# EAGLE design Power Jack Adpater (EAGLE 7.7.0)
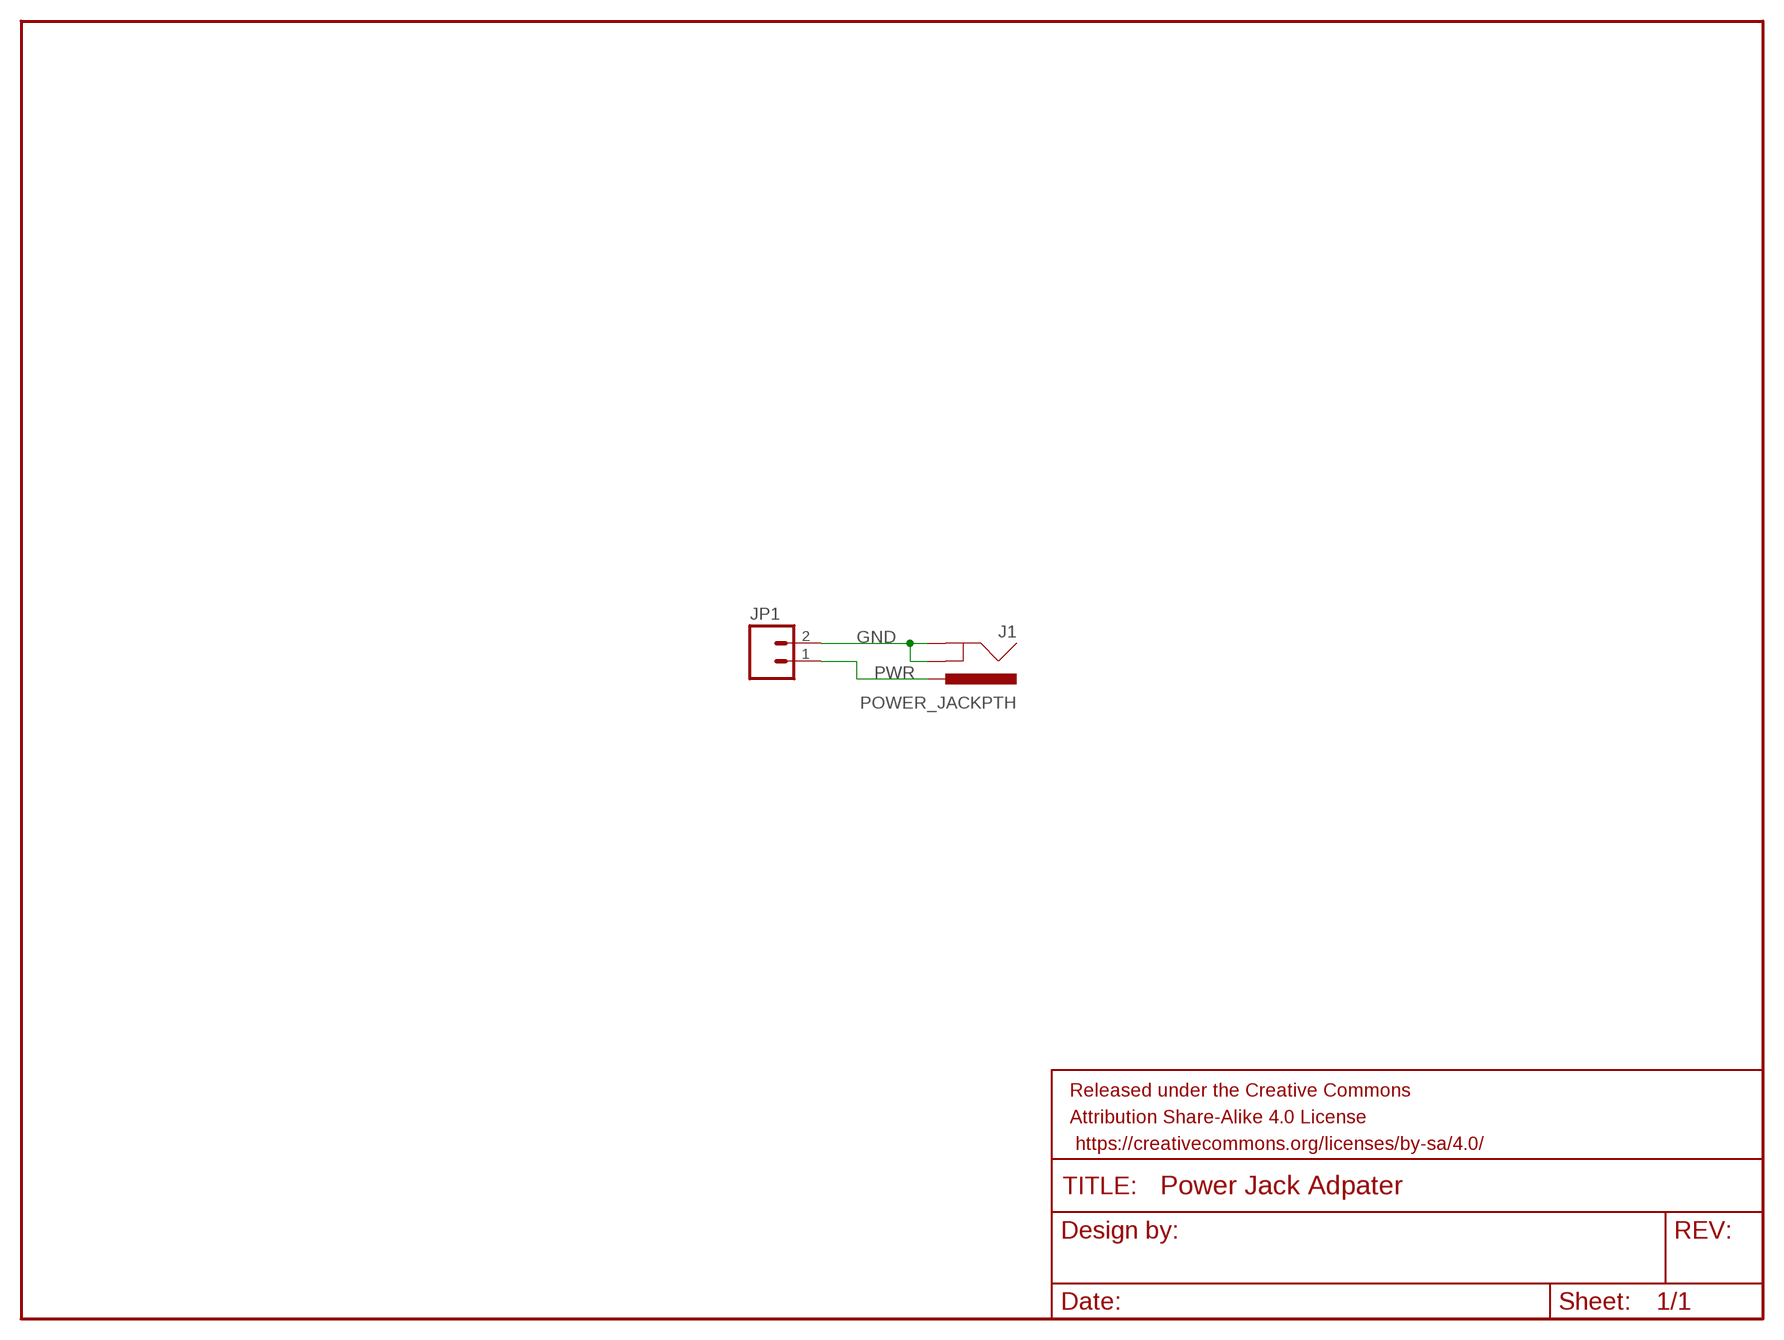
[diagram p0: schematic, sheet 1]

## Parts
FRAME1  FRAME-LETTER  [CREATIVE_COMMONS]
J1  POWER_JACKPTH  [POWER_JACK_PTH]
JP1  M02LOCK_LONGPADS  [1X02_LOCK_LONGPADS]

## Nets
GND: J1.GND J1.GNDBREAK JP1.2
PWR: J1.PWR JP1.1

## Library data of the parts
FRAME1 = 1-Generic:FRAME-LETTER: Schematic Frame Standard 8.5x11 US Letter frame
J1 = SparkFun:POWER_JACK: Power Jack This is the standard 5.5mm barrel jack for power. The PTH is the most common, proven, reliable, footprint. All others are experimental. The Slot footprint only works if the mill layer is transmitted to the PCB fab house so be warned. Spark Fun Electronics SKU : PRT-00119. Mating wall wart : TOL-00298 (and others)
JP1 = 1-Generic:M02: Header 2 Standard 2-pin 0.1" header. Use with straight break away headers (SKU : PRT-00116), right angle break away headers (PRT-00553), swiss pins (PRT-00743), machine pins (PRT-00117), and female headers (PRT-00115). Molex polarized connector foot print use with SKU : PRT-08233 with associated crimp pins and housings.

## Board
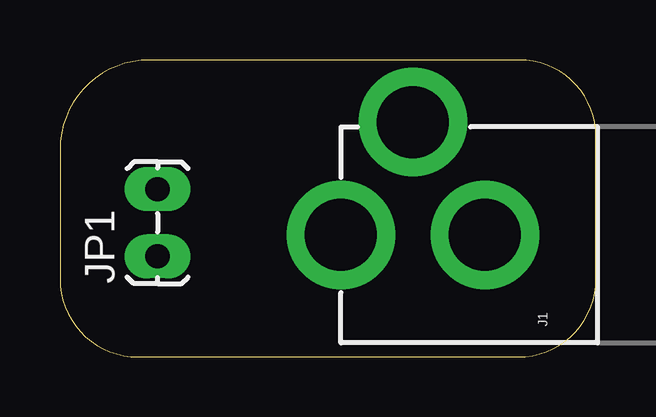
[diagram p1: board, top side]
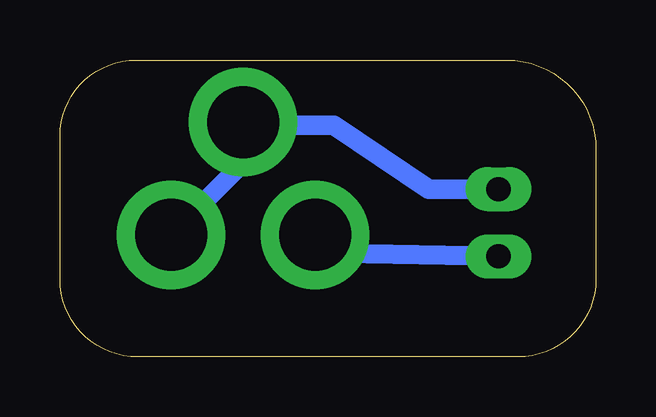
[diagram p2: board, bottom side, seen from below]

Size 22.33 x 12.37 mm. Coordinates in mm from the lower left corner, seen from the top.
Outline: 22.33,3.24 22.33,9.18 arc90 19.14,12.37 3.72,12.37 arc90 0,8.65 0,3.25 arc90 3.25,0 19.09,0 arc90 22.33,3.24
Copper layers (1*16): Top 0.035mm / dielectric 1.5mm / Bottom 0.035mm
Design rules "OthermillDRC_30_deg_v2 *": minimum track width 6mil, minimum drill 0.8mm, track to track 6mil, track to pad 6mil, pad to pad 6mil, via to via 6mil, smd to smd 0mil, copper to edge 0mil, drill to drill 6mil, minimum pad ring 10mil, minimum via ring 10mil, stop-mask expansion 1mil, vias tented up to drill 30mil, thermal gap 6mil

### Footprints (pad centres in the part's own frame; a part is rotated, then mirrored left to right if it is on the bottom)
POWER_JACK_PTH = drill 2.997: GND 0,7.7; GNDBREAK 4.7,10.7; PWR 0,13.7
1X02_LOCK_LONGPADS = drill 1.016 long: 1 -0.127,0; 2 2.667,0

### Placement (x,y rotation side)
FRAME1  -101.6,19.05 0 top  (outside the outline)
J1  25.4,5.08 90 top
JP1  4.06,4.32 90 top

### Tracks (layer width: path | path; a pad name or v marks a point on that pad's centre or on a via)
GND
  Bottom 0.813: JP1.2 6.96,6.99 10.92,9.65 14.57,9.65 J1.GNDBREAK 14.7,8.08 J1.GND
PWR
  Bottom 0.813: JP1.1 10.68,4.32 J1.PWR